# EAGLE design contact_sensor (EAGLE 8.5.0)
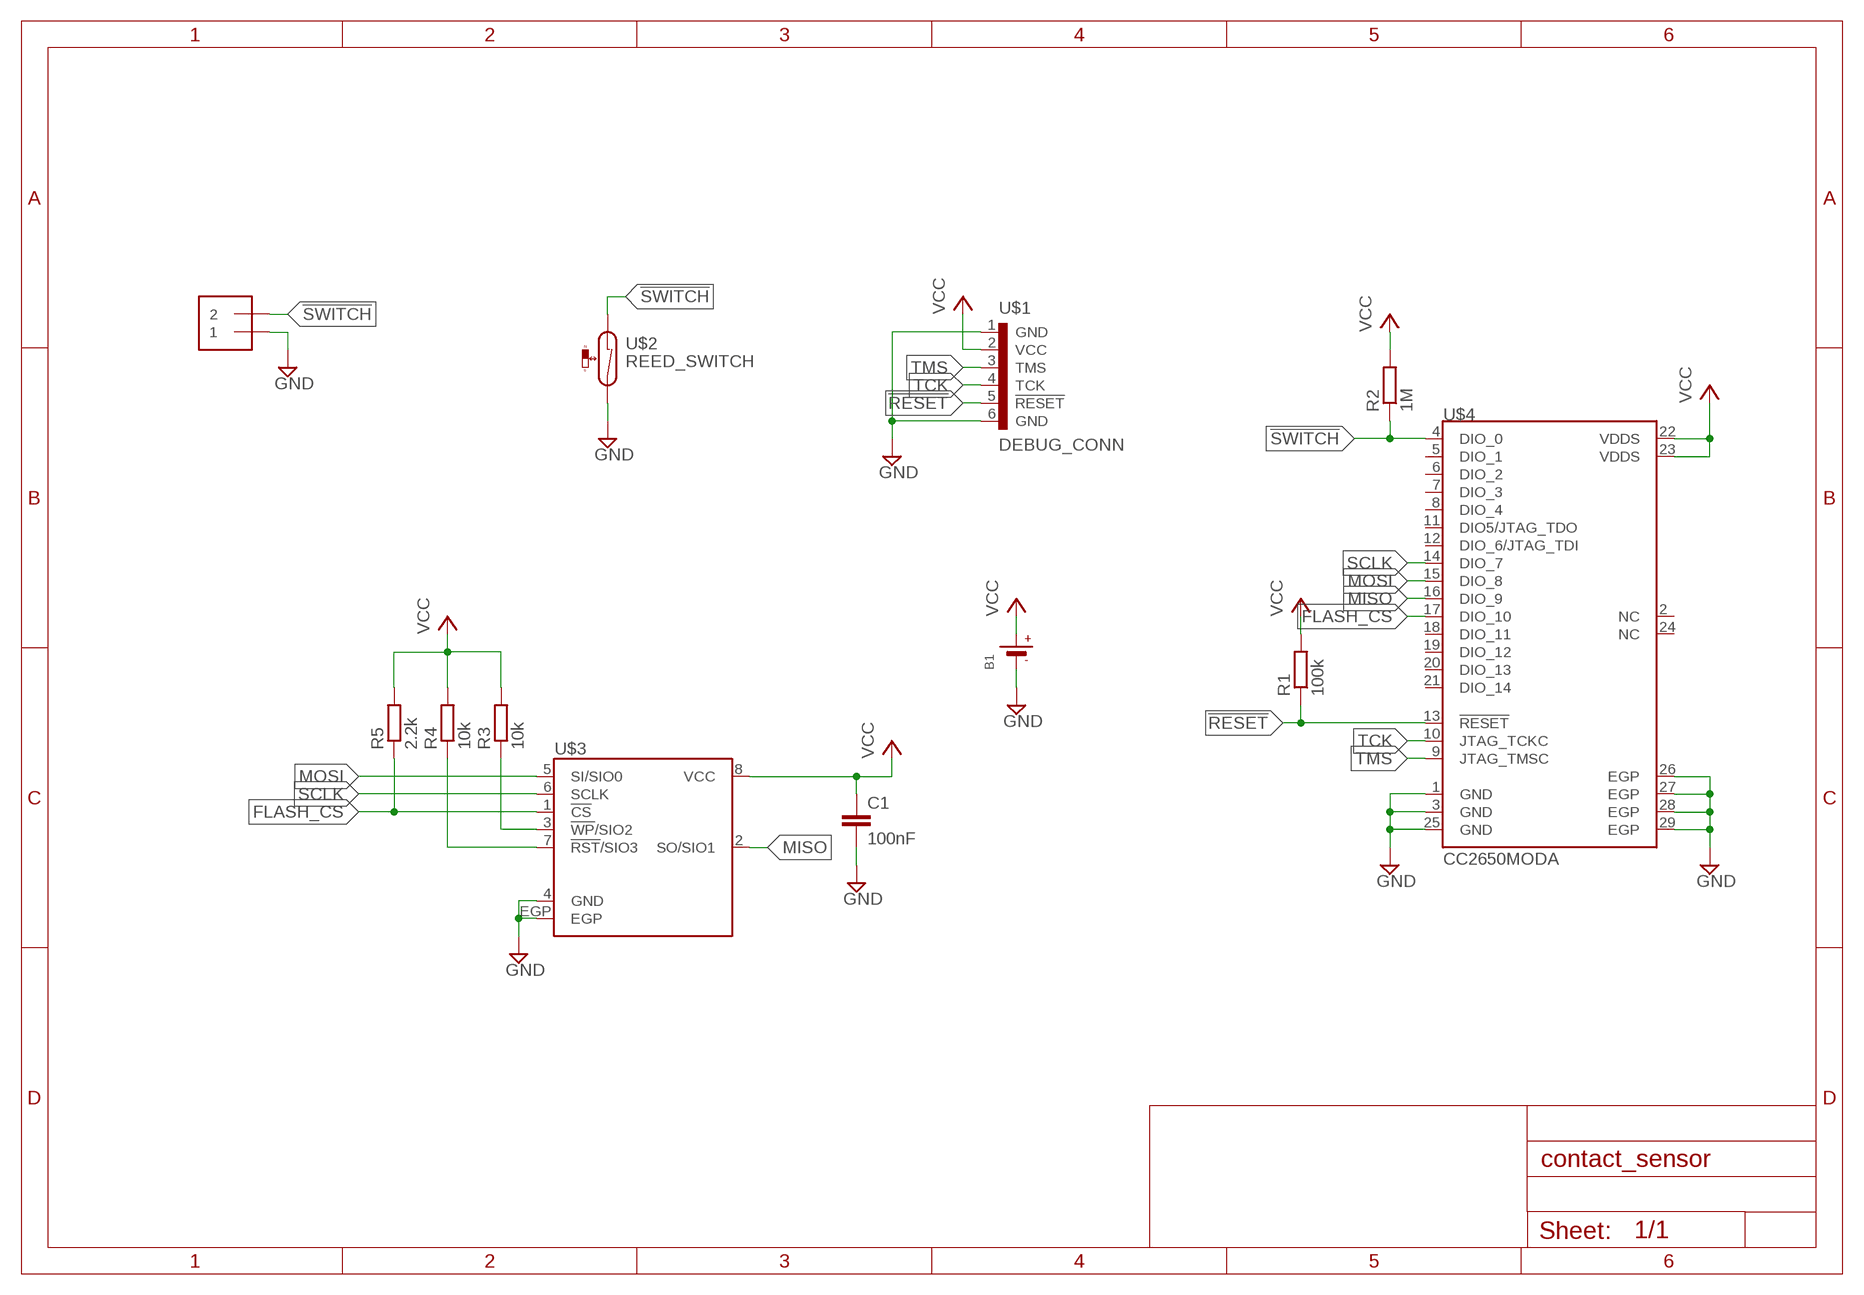
[diagram p0: schematic, sheet 1]

## Parts
B1  BATTERYCR2032_BAT-HLD-001  [CR2032_SMT_BAT-HLD-001]
C1  100nF  CAPACITOR_0402  [0402]
J2  1X2-3.5MM  [1X2-3.5MM]
R1  100k  RESISTOR_0402  [0402]
R2  1M  RESISTOR_0402  [0402]
R3  10k  RESISTOR_0402  [0402]
R4  10k  RESISTOR_0402  [0402]
R5  2.2k  RESISTOR_0402  [0402]
U$1  DEBUG_CONN  [DEBUG_CONN]
U$2  REED_SWITCH  [REED_SWITCH]
U$3  MX25R8035FMX25R8035FZUIL0  [MX25R8035FZUIL0]
U$4  CC2650MODA  [CC2650MODA]

## Nets
!RESET: R1.1 U$1.5(!RESET) U$4.13(!RESET)
!SWITCH: J2.2 R2.1 U$2.1 U$4.4(DIO_0)
FLASH_CS: R5.1 U$3.1(!CS) U$4.17(DIO_10)
GND: B1.- C1.2 J2.1 U$1.1(GND) U$1.6(GND) U$2.2 U$3.4(GND) U$3.EGP U$4.1(GND) U$4.3(GND) U$4.25(GND) U$4.26(EGP) U$4.27(EGP) U$4.28(EGP) U$4.29(EGP)
MISO: U$3.2(SO/SIO1) U$4.16(DIO_9)
MOSI: U$3.5(SI/SIO0) U$4.15(DIO_8)
N$1: R3.1 U$3.3(!WP!/SIO2)
N$2: R4.1 U$3.7(!RST!/SIO3)
SCLK: U$3.6(SCLK) U$4.14(DIO_7)
TCK: U$1.4(TCK) U$4.10(JTAG_TCKC)
TMS: U$1.3(TMS) U$4.9(JTAG_TMSC)
VCC: B1.+$1(+) B1.+$2(+) C1.1 R1.2 R2.2 R3.2 R4.2 R5.2 U$1.2(VCC) U$3.8(VCC) U$4.22(VDDS) U$4.23(VDDS)
Unconnected: U$4.2(NC) U$4.5(DIO_1) U$4.6(DIO_2) U$4.7(DIO_3) U$4.8(DIO_4) U$4.11(DIO5/JTAG_TDO) U$4.12(DIO_6/JTAG_TDI) U$4.18(DIO_11) U$4.19(DIO_12) U$4.20(DIO_13) U$4.21(DIO_14) U$4.24(NC)

## Library data of the parts
B1 = microbuilder:BATTERY: CR1220 SMT - Digikey: 3001K-ND CD2032 BAT-HLD-001 - Digikey: BAT-HLD-001-ND
C1 = mine:CAPACITOR
J2 = adafruit:1X2: 3.5mm Terminal block http://www.ladyada.net/library/pcb/eaglelibrary.html
R1-R5 = mine:RESISTOR
U$1 = mine:DEBUG_CONN
U$2 = mine:REED_SWITCH
U$3 = mine:MX25R8035F
U$4 = mine:CC2650MODA

## Board
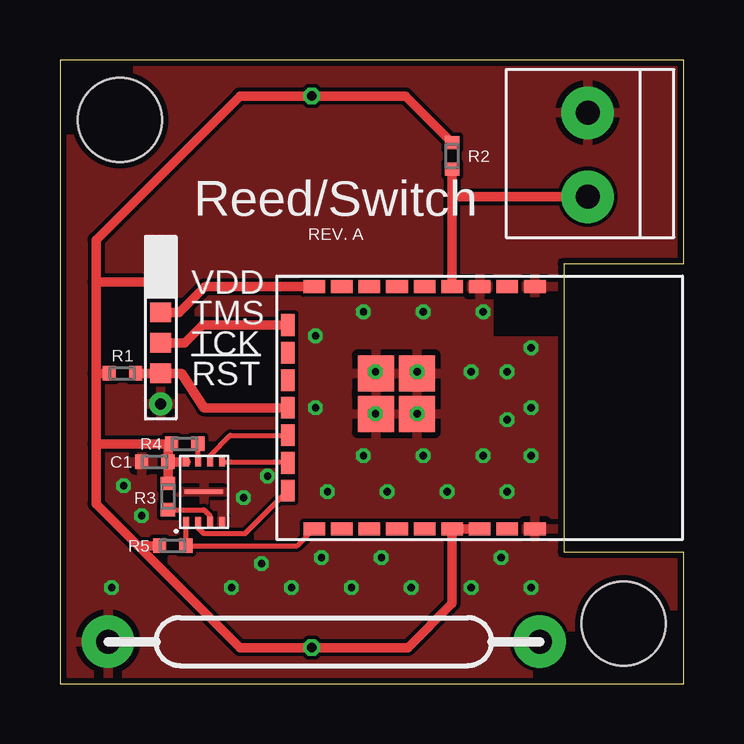
[diagram p1: board, top side]
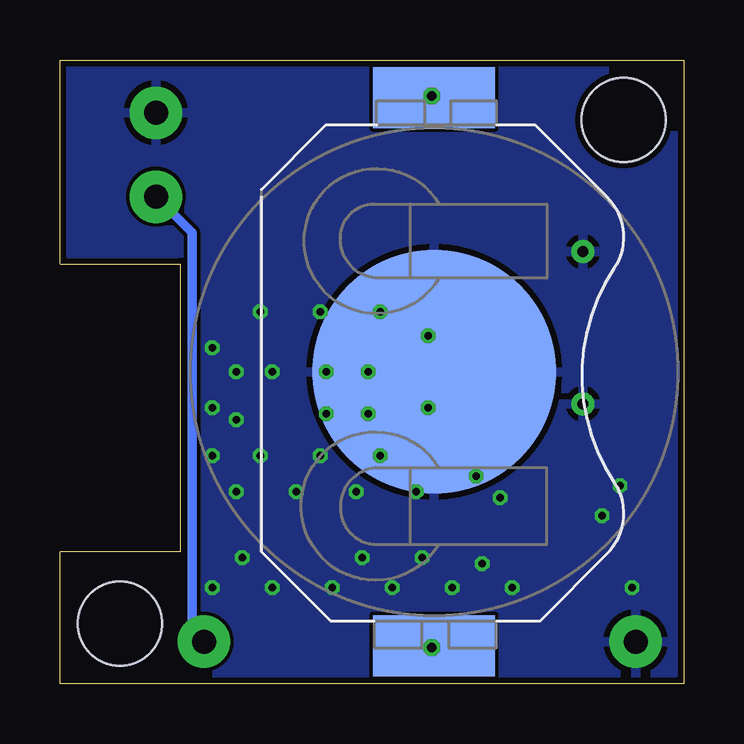
[diagram p2: board, bottom side, seen from below]

Size 26 x 26 mm. Coordinates in mm from the lower left corner, seen from the top.
Outline: 0,0 26,0 26,5.5 21,5.5 21,17.5 26,17.5 26,26 0,26 0,0
Copper layers (1*16): Top 0.035mm / dielectric 1.5mm / Bottom 0.035mm
Design rules "SeeedStudio_2layer_DRU_no_angle_20140221_fixed_drill_size": minimum track width 6mil, minimum drill 0.3mm, track to track 6mil, track to pad 6mil, pad to pad 6mil, via to via 6mil, smd to smd 0mil, copper to edge 10mil, drill to drill 10mil, minimum pad ring 10mil, minimum via ring 6mil, stop-mask expansion 2mil, vias tented up to drill 100mil, thermal gap 10mil
Holes 3.5 mm at 2.5,23.5 23.5,2.5 2.5,23.5

### Footprints (pad centres in the part's own frame; a part is rotated, then mirrored left to right if it is on the bottom)
CR2032_SMT_BAT-HLD-001 = smd 2.54 x 5.08: +$1 -11.43,0; +$2 11.43,0 | smd 10.16 x 10.16: - 0,0
0402 = smd 0.55 x 0.6: 1 -0.55,0; 2 0.55,0
1X2-3.5MM = drill 1 pad 2.184: 1 1.8,0; 2 -1.7,0
DEBUG_CONN = drill 0.457: 1 0,3.81; 6 0,-2.54 | smd 0.889 x 0.813: 2 0,2.54; 3 0,1.27; 4 0,0; 5 0,-1.27
REED_SWITCH = drill 1 pad 2.184: 1 9,0; 2 -9,0
MX25R8035FZUIL0 = smd 0.25 x 0.4: 1 0.75,1.25; 2 0.25,1.25; 3 -0.25,1.25; 4 -0.75,1.25; 5 -0.75,-1.25; 6 -0.25,-1.25; 7 0.25,-1.25; 8 0.75,-1.25 | smd 1.6 x 0.2: EGP 0,0
CC2650MODA = smd 0.55 x 0.9: 1 -5.05,2.3; 2 -5.05,1.15; 3 -5.05,0; 4 -5.05,-1.15; 5 -5.05,-2.3; 6 -5.05,-3.45; 7 -5.05,-4.6; 8 -5.05,-5.75; 9 -5.05,-6.9; 17 5.05,-6.9; 18 5.05,-5.75; 19 5.05,-4.6; 20 5.05,-3.45; 21 5.05,-2.3; 22 5.05,-1.15; 23 5.05,0; 24 5.05,1.15; 25 5.05,2.3 | smd 0.9 x 0.55: 10 -3.45,-8; 11 -2.3,-8; 12 -1.15,-8; 13 0,-8; 14 1.15,-8; 15 2.3,-8; 16 3.45,-8 | smd 1.5 x 1.5: 26 -1.435,-2.625; 27 -1.435,-4.325; 28 0.265,-4.325; 29 0.265,-2.625

### Placement (x,y rotation side)
B1  10.4,13 90 bottom
C1  3.95,9.25 180 top
J2  22,22 90 top
R1  2.6,12.93 180 top
R2  16.35,22 90 top
R3  4.5,7.8 90 top
R4  5.2,10 180 top
R5  4.7,5.75 180 top
U$1  4.2,14.2 0 top
U$2  11,1.75 0 top
U$3  6,8 180 top
U$4  17.5,11.5 270 top

### Tracks (layer width: path | path; a pad name or v marks a point on that pad's centre or on a via)
!RESET
  Top 0.4: R1.1 U$1.5 5.07,12.93 6,11.5 U$4.13
!SWITCH
  Top 0.4: U$4.4 16.35,20.3 | 16.35,20.3 J2.2 | R2.1 16.35,20.3
  Bottom 0.4: J2.2 20.5,18.8 20.5,2.25 U$2.1
FLASH_CS
  Top 0.2: U$4.17 9.9,5.75 R5.1 U$3.1
GND  (via drill 0.3)
  other vias: 13.15,13 13.15,11.25 14.9,13 14.9,11.25 19.65,14 17.65,15.5 15.15,15.5 12.65,15.5 10.65,14.5 18.65,13 17.65,9.5 16.15,8 13.65,8 11.15,8 10.65,11.5 12.65,9.5 15.15,9.5 18.65,8 19.65,9.5 19.65,11.5 17.15,13 18.65,11 19.65,4 17.15,4 18.4,5.25 14.65,4 12.15,4 9.65,4 7.15,4 13.4,5.25 10.9,5.25 8.4,5 2.15,4 2.65,8.25 3.4,7 7.65,7.75 8.65,8.65
  pour Bottom: 0.4,25.6 25.6,25.6 25.6,17.9 20.6,17.9 20.6,5.1 25.6,5.1 25.6,0.4 0.4,0.4
  pour Top: 0.4,25.6 25.6,25.6 25.6,17.9 20.6,17.9 20.6,5.1 25.6,5.1 25.6,0.4 0.4,0.4
MISO
  Top 0.2: U$4.16 7.7,6.25 6,6.25 5.75,6.5 U$3.2
MOSI
  Top 0.2: U$3.5 9.45,9.25 U$4.15
N$1
  Top 0.2: R3.1 6,7.25 6.25,7 U$3.3
N$2
  Top 0.2: U$3.7 R4.1
SCLK
  Top 0.2: U$4.14 7.1,10.35 6.25,9.5 U$3.6
TCK
  Top 0.4: U$1.4 5.2,14.2 5.95,14.95 U$4.10
TMS
  Top 0.4: U$1.3 4.97,15.47 6.05,16.55 U$4.9
VCC  (via drill 0.4)
  Top 0.4: U$4.23 U$4.22 16.35,3.35 14.5,1.5 v10.5,1.5 7.5,1.5 3.25,5.75 | 1.5,16.74 1.5,18.5 7.5,24.5 v10.5,24.5 14.4,24.5 R2.2 | 1.5,16.74 1.5,12.93 | 1.5,12.93 1.5,10 | 1.5,10 1.5,7.5 3.25,5.75 | U$1.2 1.5,16.74 | R1.2 1.5,12.93 | U$3.8 C1.1 | R4.2 4.5,10 | 4.5,10 C1.1 | 4.5,10 1.5,10 | R3.2 C1.1 | R5.2 3.25,5.75
  Bottom 0.4: B1.+$2 10.47,24.5 v10.5,24.5 | v10.5,1.5 10.43,1.57 B1.+$1

### Text on the board
tPlace: Reed/Switch | REV. A